# EAGLE design lipo-booster (EAGLE 9.3.0)
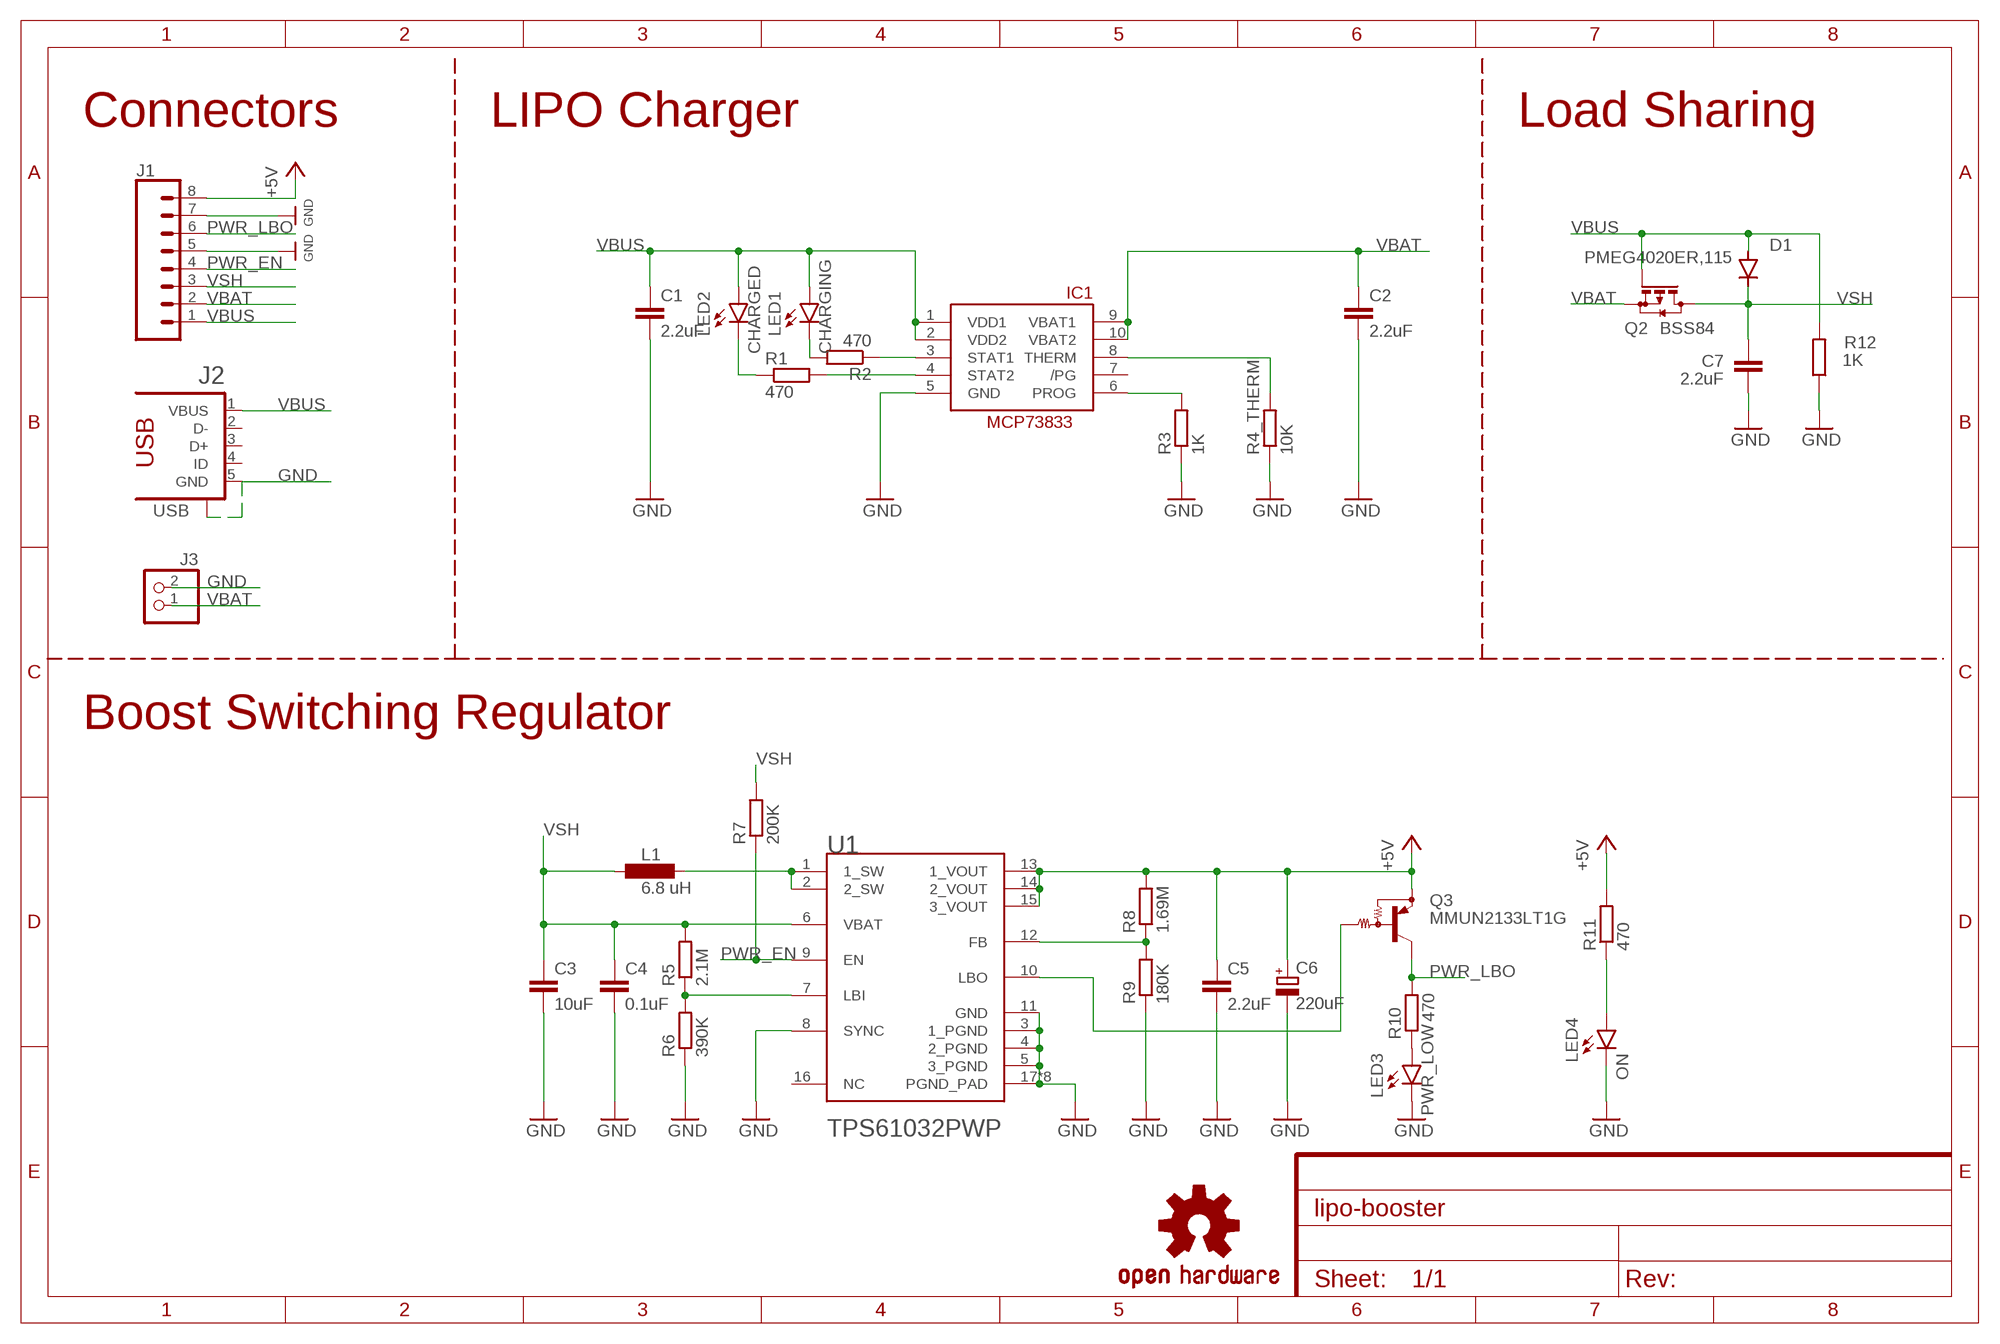
[diagram p0: schematic, sheet 1]

## Parts
C1  2.2uF  C-EUC0603  [C0603]
C2  2.2uF  C-EUC0603  [C0603]
C3  10uF  C-EUC0603  [C0603]
C4  0.1uF  C-EUC0603  [C0603]
C5  2.2uF  C-EUC0603  [C0603]
C6  220uF  CPOL-EUCT3528  [CT3528]
C7  2.2uF  C-EUC0603  [C0603]
D1  PMEG4020ER,115  CGRM4001-G  [SOD-123_MINI-SMA]
IC1  MCP73833-UN  [MSOP10]
J1  CONN_08"  [1X08]
J2  USB  1981584-1  [1981584-1]
J3  JST_2PIN-THM  [JST-PH-2-THM]
L1  6.8 uH  L-EUWE-TPC  [POWER-CHOKE_WE-TPC]
LED1  CHARGING  LEDCHIP-LED0603  [CHIP-LED0603]
LED2  CHARGED  LEDCHIP-LED0603  [CHIP-LED0603]
LED3  PWR_LOW  LEDCHIP-LED0603  [CHIP-LED0603]
LED4  ON  LEDCHIP-LED0603  [CHIP-LED0603]
LOGO1  OSHW-LOGOS  [OSHW-LOGO-S]
Q2  BSS84  [SOT23]
Q3  MMUN2133LT1G  MUN2114T1  [SC59-BEC]
R1  470  R-EU_R0603  [R0603]
R2  470  R-EU_R0603  [R0603]
R3  1K  R-EU_R0603  [R0603]
R4_THERM  10K  R-EU_R0603  [R0603]
R5  2.1M  R-EU_R0603  [R0603]
R6  390K  R-EU_R0603  [R0603]
R7  200K  R-EU_R0603  [R0603]
R8  1.69M  R-EU_R0603  [R0603]
R9  180K  R-EU_R0603  [R0603]
R10  470  R-EU_R0603  [R0603]
R11  470  R-EU_R0603  [R0603]
R12  1K  R-EU_R0603  [R0603]
U1  TEXAS_INSTRUMENTS_TPS61032PWPTEXAS_INSTRUMENTS_TPS61030PWP_0_0  [TEXAS_INSTRUMENTS_TPS61032PWP_0]

## Nets
+5V: C5.1 C6.-(+) J1.8 Q3.E R8.2 R11.2 U1.13(1_VOUT) U1.14(2_VOUT) U1.15(3_VOUT)
GND: C1.2 C2.2 C3.2 C4.2 C5.2 C6.+(-) C7.2 IC1.5(GND) J1.5 J1.7 J2.5(GND) J2.S1 J3.2 LED3.C LED4.C R3.1 R4_THERM.1 R6.1 R9.1 R12.1 U1.3(1_PGND) U1.4(2_PGND) U1.5(3_PGND) U1.8(SYNC) U1.11(GND) U1.17(PGND_PAD) U1.PAD_1(PGND_PAD) U1.PAD_2(PGND_PAD) U1.PAD_3(PGND_PAD) U1.PAD_4(PGND_PAD) U1.PAD_5(PGND_PAD) U1.PAD_6(PGND_PAD) U1.SMD_33(PGND_PAD)
N$1: L1.1 U1.1(1_SW) U1.2(2_SW)
N$2: LED4.A R11.1
N$3: LED3.A R10.1
N$4: IC1.8(THERM) R4_THERM.2
N$5: IC1.3(STAT1) R2.1
N$6: IC1.4(STAT2) R1.2
N$11: LED1.C R2.2
N$19: IC1.6(PROG) R3.2
N$22: LED2.C R1.1
N$30: R5.1 R6.2 U1.7(LBI)
N$32: Q3.B U1.10(LBO)
N$33: R8.1 R9.2 U1.12(FB)
PWR_EN: J1.4 R7.1 U1.9(EN)
PWR_LBO: J1.6 Q3.C R10.2
VBAT: C2.1 IC1.9(VBAT1) IC1.10(VBAT2) J1.2 J3.1 Q2.2(S)
VBUS: C1.1 D1.A IC1.1(VDD1) IC1.2(VDD2) J1.1 J2.1(VBUS) LED1.A LED2.A Q2.1(G) R12.2
VSH: C3.1 C4.1 C7.1 D1.C J1.3 L1.2 Q2.3(D) R5.2 R7.2 U1.6(VBAT)
Unconnected: IC1.7(/PG) J2.2(D-) J2.3(D+) J2.4(ID) U1.16(NC)

## Notes on the sheet
- Connectors | LIPO Charger | Load Sharing
- Boost Switching Regulator

## Library data of the parts
C1-C5 C7 = resistor:C-EU: CAPACITOR, European symbol
C6 = resistor:CPOL-EU: POLARIZED CAPACITOR, European symbol
D1 = diode:CGRM400*-G: Molded plasitc,JEDEC SOD-123/Mini SMA Source: Comchip CGRM4001-G.pdf; SPICEPREFIX: D
IC1 = adafruit:MCP73833
J1 = SparkFun-Connectors:CONN_08: Multi connection point. Often used as Generic Header-pin footprint for 0.1 inch spaced/style header connections On any of the 0.1 inch spaced packages, you can populate with these: Break Away Headers - Straight <https://www.sparkfun.com/products/116> (PRT-00116) Break Away Male Headers - Right Angle <https://www.sparkfun.com/products/553> (PRT-00553) Female Headers <https://www.sparkfun.com/products/115> (PRT-00115) Break Away Headers - Machine Pin <https://www.sparkfun.com/products/117> (PRT-00117) Break Away Female Headers - Swiss Machine Pin <https://www.sparkfun.com/products/743> (PRT-00743) Arduino Stackable Header - 8 Pin <https://www.sparkfun.com/products/9279> (PRT-09279) For SCREWTERMINALS and SPRING TERMINALS visit here: Screw Terimnals on SparkFun.com <https://www.sparkfun.com/search/results?term=Screw+Terminals> (5mm/3.5mm/2.54mm spacing) This device is also useful as a general connection point to wire up your design to another part of your project. Our various solder wires solder well into these plated through hole pads. Hook-Up Wire - Assortment (Stranded, 22 AWG) <https://www.sparkfun.com/products/11375> (PRT-11375) Hook-Up Wire - Assortment (Solid Core, 22 AWG) <https://www.sparkfun.com/products/11367> (PRT-11367) View the entire wire category on our website here <https://www.sparkfun.com/categories/141> Special notes: Molex polarized connector foot print use with SKU : PRT-08231 with associated crimp pins and housings. 1MM SMD Version SKU: PRT-10208 NOTES ON THE VARIANTS LOCK and LOCK_LONGPADS... This footprint was designed to help hold the alignment of a through-hole component (i.e. 6-pin header) while soldering it into place. You may notice that each hole has been shifted either up or down by 0.005 of an inch from it's more standard position (which is a perfectly straight line). This slight alteration caused the pins (the squares in the middle) to touch the edges of the holes. Because they are alternating, it causes a "brace" to hold the component in place. 0.005 has proven to be the perfect amount of "off-center" position when using our standard breakaway headers. Although looks a little odd when you look at the bare footprint, once you have a header in there, the alteration is very hard to notice. Also,if you push a header all the way into place, it is covered up entirely on the bottom side.; PROD_ID: CONN-08438
J2 = audio amplifier example:1981584-1: Receptacle, micro-USB, type A/B Tyco Electronics
J3 = adafruit:JST_2PIN: JST 2-Pin Connectors of various flavors SMT-RA (S2B-PH-SM4) 4UConnector #17311 SMT (B2B-PH-SM4) THM-RA (S2B-PH) THM (B2B-PH)
L1 = resistor:L-EU: INDUCTOR, European symbol
LED1-LED4 = led:LED: LED OSRAM: - CHIPLED LG R971, LG N971, LY N971, LG Q971, LY Q971, LO R971, LY R971 LH N974, LH R974 LS Q976, LO Q976, LY Q976 LO Q996 - Hyper CHIPLED LW Q18S LB Q993, LB Q99A, LB R99A - SideLED LS A670, LO A670, LY A670, LG A670, LP A670 LB A673, LV A673, LT A673, LW A673 LH A674 LY A675 LS A676, LA A676, LO A676, LY A676, LW A676 LS A679, LY A679, LG A679 - Hyper Micro SIDELED® LS Y876, LA Y876, LO Y876, LY Y876 LT Y87S - SmartLED LW L88C, LW L88S LB L89C, LB L89S, LG L890 LS L89K, LO L89K, LY L89K LS L896, LA L896, LO L896, LY L896 - TOPLED LS T670, LO T670, LY T670, LG T670, LP T670 LSG T670, LSP T670, LSY T670, LOP T670, LYG T670 LG T671, LOG T671, LSG T671 LB T673, LV T673, LT T673, LW T673 LH T674 LS T676, LA T676, LO T676, LY T676, LB T676, LH T676, LSB T676, LW T676 LB T67C, LV T67C, LT T67C, LS T67K, LO T67K, LY T67K, LW E67C LS E67B, LA E67B, LO E67B, LY E67B, LB E67C, LV E67C, LT E67C LW T67C LS T679, LY T679, LG T679 LS T770, LO T770, LY T770, LG T770, LP T770 LB T773, LV T773, LT T773, LW T773 LH T774 LS E675, LA E675, LY E675, LS T675 LS T776, LA T776, LO T776, LY T776, LB T776 LHGB T686 LT T68C, LB T68C - Hyper Mini TOPLED® LB M676 - Mini TOPLED Santana® LG M470 LS M47K, LO M47K, LY M47K Source: http://www.osram.convergy.de LUXEON: - LUMILED® LXK2-PW12-R00, LXK2-PW12-S00, LXK2-PW14-U00, LXK2-PW14-V00 LXK2-PM12-R00, LXK2-PM12-S00, LXK2-PM14-U00 LXK2-PE12-Q00, LXK2-PE12-R00, LXK2-PE12-S00, LXK2-PE14-T00, LXK2-PE14-U00 LXK2-PB12-K00, LXK2-PB12-L00, LXK2-PB12-M00, LXK2-PB14-N00, LXK2-PB14-P00, LXK2-PB14-Q00 LXK2-PR12-L00, LXK2-PR12-M00, LXK2-PR14-Q00, LXK2-PR14-R00 LXK2-PD12-Q00, LXK2-PD12-R00, LXK2-PD12-S00 LXK2-PH12-R00, LXK2-PH12-S00 LXK2-PL12-P00, LXK2-PL12-Q00, LXK2-PL12-R00 Source: www.luxeon.com KINGBRIGHT: KA-3528ASYC Source: www.kingbright.com
LOGO1 = SparkFun-Aesthetics:OSHW-LOGO: Open-Source Hardware (OSHW) Logo This logo indicates the piece of hardware it is found on incorporates a OSHW license and/or adheres to the definition of open source hardware found here: http://freedomdefined.org/OSHW
Q2 = transistor-small-signal:BSS84: P-CHANNEL MOS FET
Q3 = transistor-pnp:MUN2114*: PNP Bias Resistor Transistor
R1-R3 R4_THERM R5-R12 = resistor:R-EU_: RESISTOR, European symbol
U1 = Texas Instruments - TPS61032PWP:TEXAS_INSTRUMENTS_TPS61032PWP: Boost Switching Regulator IC Positive Adjustable 1.8V 1 Output 3.6A (Switch) 16-TSSOP (0.173", 4.40mm Width) Exposed Pad; CENTROID_NOT_SPECIFIED: No; CURRENT_-_OUTPUT: 3.6A (Switch); DATASHEET: http://www.ti.com/lit/gpn/tps61030; DIGIKEY_DESCRIPTION: IC Boost Switching Regulator IC Positive Adjustable 1.8V 1 Output 3.6A (Switch) 16-TSSOP (0.173", 4.40mm Width) Exposed Pad; DIGIKEY_PART_NUMBER: 296-27006-5-ND; FREQUENCY_-_SWITCHING: 600kHz; FUNCTION: Step-Up; LEAD_FREE: yes; MF: Texas Instruments; MFG_PACKAGE_IDENT: PWP (R-PDSO-G16); MOUSER_PART_NUMBER: 595-TPS61030PWP; MPN: TPS61030PWP; OUTPUT_TYPE: Adjustable; PACKAGE: HTSSOP16; PREFIX: U; ROHS: yes; TEMPERATURE_RANGE_HIGH: +85°C; TEMPERATURE_RANGE_LOW: -40°C; VOLTAGE_-_INPUT_(MAX): 5.5V; VOLTAGE_-_INPUT_(MIN): 1.8V; VOLTAGE_-_OUTPUT_(MAX): 5.5V; VOLTAGE_-_OUTPUT_(MIN/FIXED): 1.8V

## Net classes
0 default: width 0.254 mm, clearance 0.2 mm
1 vcc: width 0.254 mm

## Board
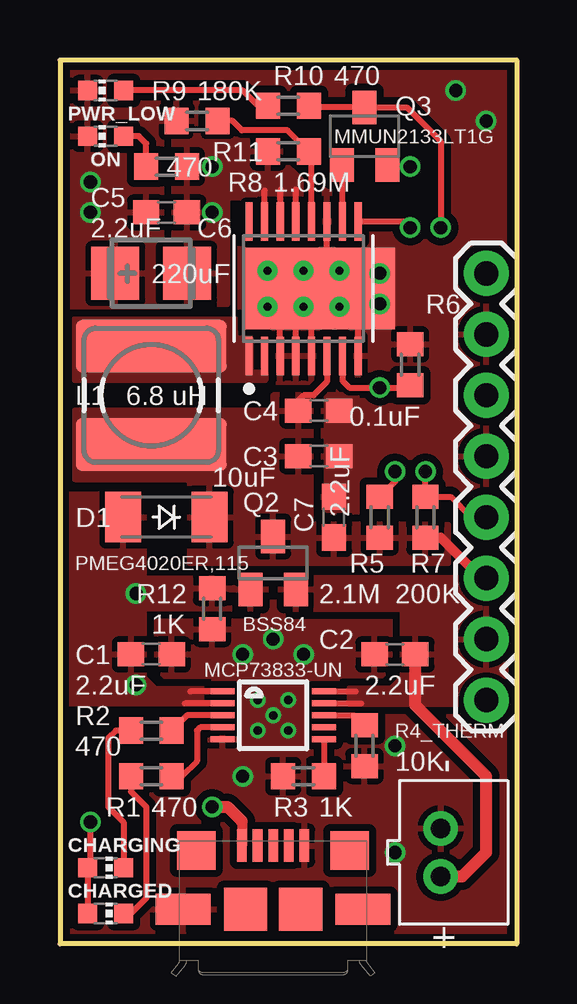
[diagram p1: board, top side]
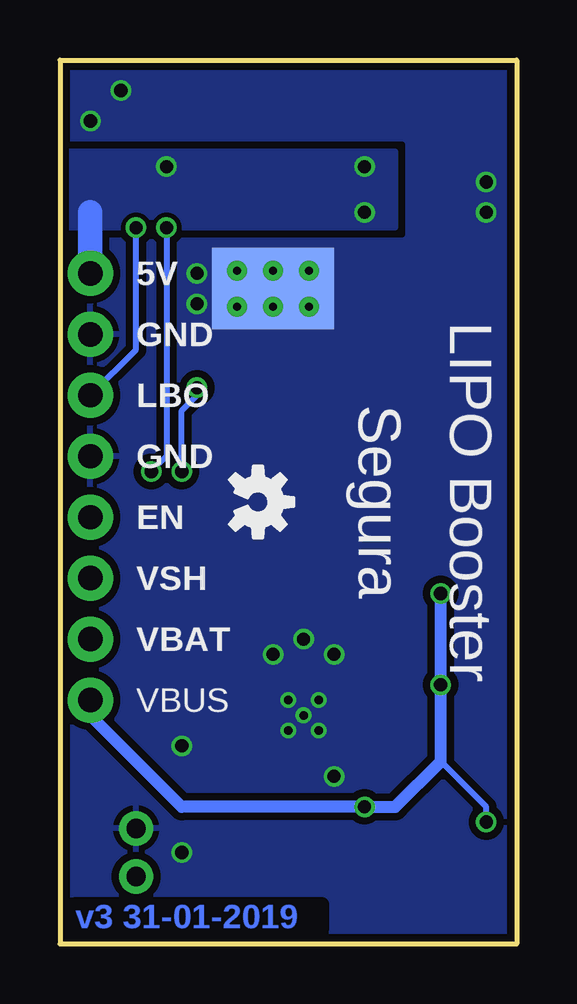
[diagram p2: board, bottom side, seen from below]

Size 19.05 x 36.83 mm. Coordinates in mm from the lower left corner, seen from the top.
Outline: 19.05,0 0,0 0,36.83 19.05,36.83 19.05,0
Copper layers (1*16): Top 0.035mm / dielectric 1.5mm / Bottom 0.035mm
Design rules "dirt_cheap_dirty_boards.v1": minimum track width 5mil, minimum drill 12mil, track to track 5mil, track to pad 5mil, pad to pad 5mil, via to via 5mil, smd to smd 0mil, copper to edge 10mil, drill to drill 10mil, minimum pad ring 10mil, minimum via ring 6mil, stop-mask expansion 2mil, vias tented up to drill 25mil, thermal gap 10mil
tRestrict: area 21.7,-32.7 to 21.8,-32.3; area 23.6,-28.6 to 23.7,-28.2; area 23,-28.6 to 23.1,-28.2

### Footprints (pad centres in the part's own frame; a part is rotated, then mirrored left to right if it is on the bottom)
C0603 = smd 1.1 x 1: 1 -0.85,0; 2 0.85,0
CT3528 = smd 2 x 2.2: + -1.5,0; - 1.5,0
SOD-123_MINI-SMA = smd 1.5 x 2.1: A 1.8,0; C -1.8,0
MSOP10 = smd 0.25 x 1: 1 -1,-2.113; 2 -0.5,-2.113; 3 0,-2.113; 4 0.5,-2.113; 5 1,-2.113; 6 1,2.113; 7 0.5,2.113; 8 0,2.113; 9 -0.5,2.113; 10 -1,2.113
1X08 = drill 1.016 pad 1.88: 1 0,0; 2 2.54,0; 3 5.08,0; 4 7.62,0; 5 10.16,0; 6 12.7,0; 7 15.24,0; 8 17.78,0
1981584-1 = smd 0.4 x 1.35: 1 -1.3,4.1; 2 -0.65,4.1; 3 0,4.1; 4 0.65,4.1; 5 1.3,4.1 | smd 1.8 x 1.8: M1 -1.15,1.45; M2 1.15,1.45 | smd 2.3 x 1.3: S1 -3.75,1.45; S2 3.75,1.45 | smd 1.6 x 1.6: S3 -3.2,3.885; S4 3.2,3.885
JST-PH-2-THM = drill 0.8 pad 1.422: 1 1,0; 2 -1,0
POWER-CHOKE_WE-TPC = smd 6.3 x 2.2: 1 0,2.05; 2 0,-2.05
CHIP-LED0603 = smd 0.8 x 0.8: A 0,-0.75; C 0,0.75
SOT23 = smd 1 x 1.4: 1 -0.95,-1.1; 2 0.95,-1.1; 3 0,1.1
SC59-BEC = smd 1 x 1.4: B -0.95,-1.2; C 0,1.2; E 0.95,-1.2
R0603 = smd 1 x 1.1: 1 -0.85,0; 2 0.85,0
TEXAS_INSTRUMENTS_TPS61032PWP_0 = smd 0.3 x 1.6: 1 -2.275,-2.8; 2 -1.625,-2.8; 3 -0.975,-2.8; 4 -0.325,-2.8; 5 0.325,-2.8; 6 0.975,-2.8; 7 1.625,-2.8; 8 2.275,-2.8; 9 2.275,2.8; 10 1.625,2.8; 11 0.975,2.8; 12 0.325,2.8; 13 -0.325,2.8; 14 -0.975,2.8; 15 -1.625,2.8; 16 -2.275,2.8 | smd 6.35 x 3.4: 17 0.635,0 | drill 0.33 pad 0.63: PAD_1 -1.5,0.75; PAD_2 0,0.75; PAD_3 1.5,0.75; PAD_4 -1.5,-0.75; PAD_5 0,-0.75; PAD_6 1.5,-0.75 | smd 5.08 x 3.4 bottom: SMD_33 0,0

### Placement (x,y rotation side)
C1  3.81,12.06 0 top
C2  13.97,12.06 180 top
C3  10.79,20.32 0 top
C4  10.79,22.23 0 top
C5  4.45,30.48 180 top
C6  3.81,27.94 0 top
C7  11.43,17.78 90 top
D1  4.45,17.78 180 top
IC1  8.89,9.53 270 top
J1  17.78,10.16 90 top
J2  8.89,0 0 top
J3  15.88,3.81 270 top
L1  3.81,22.86 0 top
LED1  1.91,3.17 270 top
LED2  1.91,1.27 270 top
LED3  1.91,35.56 90 top
LED4  1.91,33.66 90 top
LOGO1  10.79,18.41 270 bottom
Q2  8.89,15.88 0 top
Q3  12.7,33.66 0 top
R1  3.81,6.99 0 top
R2  3.81,8.89 180 top
R3  10.16,6.99 0 top
R4_THERM  12.7,8.26 90 top
R5  13.34,17.78 270 top
R6  14.61,24.13 270 top
R7  15.24,17.78 270 top
R8  9.53,33.02 180 top
R9  5.71,34.29 0 top
R10  9.53,34.92 0 top
R11  4.45,32.38 0 top
R12  6.35,13.97 90 top
U1  10.16,27.3 0 top

### Tracks (layer width: path | path; a pad name or v marks a point on that pad's centre or on a via)
+5V  (via drill 0.55)
  Top 0.254: U1.15 8.54,31.39 | U1.14 9.21,30.13 9.21,31.43 | U1.13 9.84,31.43 | v14.61,32.38 13.72,32.38 Q3.E
  Bottom 1.016: J1.8 17.78,30.48
  other vias: 6.35,32.38 6.35,30.48
  pour Top: 6.99,31.11 10.16,31.11 10.16,31.75 9.21,32.7 9.21,33.66 4.76,33.66 4.76,26.67 6.99,26.67
  pour Top (no thermals): 8.26,31.27 10.16,31.27 10.16,31.43 8.26,31.43
  pour Bottom: 5.08,33.02 5.08,29.84 19.05,29.84 19.05,33.02
GND  (via drill 0.35, 0.55)
  Top 0.254: U1.8 12.44,25.66 U1.17 | U1.17 11.13,27.64 U1.11 | U1.17 11.54,26.55 U1.PAD_6 | U1.17 10.04,26.55 U1.PAD_4 | U1.17 9.41,27.3 U1.PAD_1 | U1.17 11.54,28.05 U1.PAD_3 | U1.3 9.19,25.62 | U1.4 9.84,25.71 | U1.5 10.48,25.82
  other vias: 1.27,31.75 7.62,6.99 13.34,27.94 13.97,3.81 8.89,9.53 8.26,8.89 9.53,8.89 9.53,10.16 8.26,10.16 7.62,12.06 8.89,12.7 10.16,12.06 1.27,30.48 16.51,35.56 17.78,34.29 13.34,26.67 13.97,8.26
  pour Bottom (isolate 0.305, rank 6): 0,36.83 0,0 19.05,0 19.05,36.83
  pour Top (isolate 0.305, rank 6): 0,36.83 0,0 19.05,0 19.05,36.83
  pour Top: 7.62,11.43 7.62,8.57 6.35,8.57 6.35,8.26 7.62,8.26 7.62,6.35 10.16,6.35 10.16,11.43 13.65,11.43 13.65,13.34 4.13,13.34 4.13,11.43
  pour Top (no thermals): 11.11,22.86 11.11,18.1 12.38,18.1 12.38,22.86
N$1
  pour Top (no thermals): 7.94,25.24 7.94,23.81 8.57,23.81 8.57,23.5 0.64,23.5 0.64,26.04 7.3,26.04 7.3,25.24
N$2
  Top 0.254: R11.1 3.6,33.35 3.29,33.66 LED4.A
N$3
  Top 0.254: R10.1 8.26,34.92 7.62,35.56 LED3.A
N$4
  Top 0.254: R4_THERM.2 12.28,9.53 IC1.8
N$5
  Top 0.254: IC1.3 5.29,9.53 R2.1
N$6
  Top 0.254: R1.2 5.08,6.99 5.71,7.62 5.71,8.89 5.85,9.03 IC1.4
N$11
  Top 0.254: LED1.C 2.65,5.08 2.02,5.71 2.02,8.59 2.33,8.89 R2.2
N$19
  Top 0.254: IC1.6 11.01,8.52 R3.2
N$22
  Top 0.254: LED2.C 2.96,1.27 3.6,1.91 3.6,5.71 2.96,6.35 R1.1
N$30  (via drill 0.55)
  Top 0.254: U1.7 11.79,23.46 12.06,23.18 v13.34,23.18 14.5,23.18 R6.2 | R5.1 13.97,19.27 v13.97,19.68
  Bottom 0.254: v13.97,19.68 13.97,22.23 13.34,22.86 v13.34,23.18
N$32
  Top 0.254: U1.10 11.79,32.42 Q3.B
N$33
  Top 0.254: U1.12 10.48,32.91 R8.1 9.5,33.9 7.59,33.9 7.2,34.29 R9.2
PWR_EN  (via drill 0.55)
  Top 0.254: J1.4 17.14,17.78 16.3,18.63 R7.1 v15.24,19.68 | U1.9 14.35,30.11 v14.61,29.84
  Bottom 0.254: v14.61,29.84 14.61,20.32 v15.24,19.68
PWR_LBO  (via drill 0.55)
  Top 0.254: v15.88,29.84 15.88,33.44 14.46,34.85 Q3.C 10.45,34.85 R10.2
  Bottom 0.254: J1.6 15.88,24.77 v15.88,29.84
VBAT
  Top 0.254: IC1.10 12.34,10.53 | IC1.9 12.56,10.03
  Top 0.508: J3.1 16.78,2.81 17.78,3.81 17.78,6.99 14.82,9.95 C2.1
  pour Top: 19.05,15.24 9.21,15.24 9.21,13.97 14.29,13.97 14.29,11.11 13.81,10.64 12.06,10.64 12.06,10 19.05,10
VBUS  (via drill 0.55)
  Top 0.254: LED2.A LED1.A 1.27,3.29 v1.27,5.08 | IC1.2 5.21,10.03 | IC1.1 5.45,10.53
  Top 0.406: 7.59,5.11 J2.1
  Top 0.508: 7.59,5.11 6.99,5.71 v6.35,5.71
  Bottom 0.254: 3.17,7.62 1.27,5.71 v1.27,5.08
  Bottom 0.508: v3.17,14.61 v3.17,10.79 3.17,7.62 5.08,5.71 v6.35,5.71 13.97,5.71 17.78,9.53 J1.1
  pour Top: 0,10 0,18.73 3.49,18.73 3.49,15.24 8.57,15.24 8.57,13.97 3.49,13.97 3.49,11.11 3.97,10.64 6.35,10.64 6.35,10
VSH
  Top 0.254: U1.6 11.13,23.41 10.58,22.86 10.16,22.86 9.95,22.64 C4.1
  Top 0.406: R7.2 15.88,16.93 17.57,15.24 J1.3
  pour Top: 5.4,15.88 16.19,15.88 16.19,17.46 10.48,17.46 10.48,22.86 8.89,22.86 8.89,22.23 5.4,22.23
  pour Top (no thermals): 0.64,22.23 0.64,19.37 7.62,19.37 7.62,22.23

### Text on the board
Bottom: v3 31-01-2019
bPlace: LIPO Booster | Segura
bNames: 5V | GND | LBO | GND | EN | VSH | VBAT | VBUS